# Altium project EN_Probe_VR_2.PrjPcb
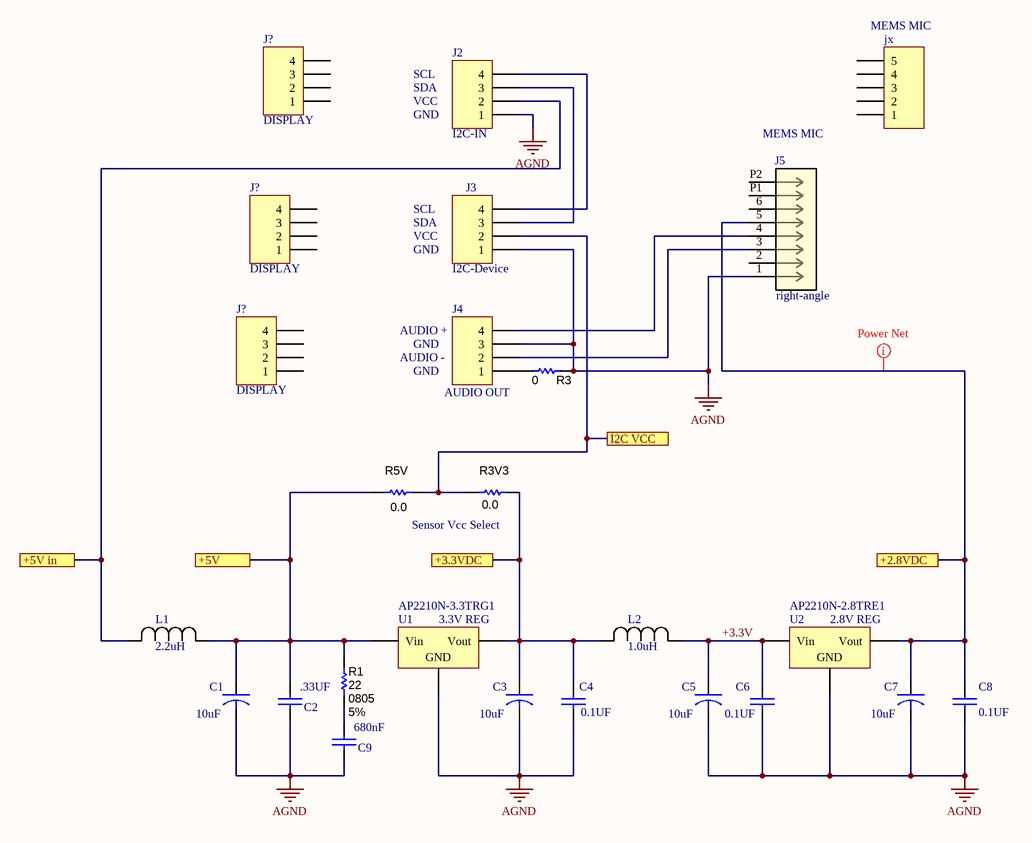
[diagram p0: EN_Probe_VR_Chain_2.SchDoc]
1 sheet, 25 parts. Net scope: flat (ports and power ports of the same name join across sheets).
Board file: EN_Probe_VR_2.PcbDoc

## Sheet EN_Probe_VR_Chain_2.SchDoc
size B

### Parts
(Parts that share a designator on the sheet are numbered #1, #2 ... from top to bottom, then left to right.)
C1  10uF  [0805]
C2  .33UF  [0805]
C3  10uF  [0805]
C4  0.1UF  [0603]
C5  10uF  [0805]
C6  0.1UF  [0603]
C7  10uF  [0805]
C8  0.1UF  [0603]
C9  680nF  [0805]
J2  I2C-IN  [HDRA1X4 2MM]
J3  I2C-Device  [HDRA1X4 2MM]
J4  AUDIO OUT  [HDRA1X4 2MM]
J5  MEMS MIC  [CON_527450697_MOL]
J?#1  DISPLAY  [HDR1X4]
J?#2  DISPLAY  [HDR1X4]
J?#3  DISPLAY  [HDR1X4]
jx  MEMS MIC  [HDR1X5]
L1  2.2uH  [1206]
L2  1.0uH  [1206]
R1  ValueDisplayed: 22  Value1: 5%  [0805]  (hidden comment: CRCW080522R0JNEA)
R3  ValueDisplayed: 0  [0805]  (hidden comment: CRCW080522R0JNEA)
R3V3  ValueDisplayed: 0.0  [0805]  (hidden comment: CRCW080522R0JNEA)
R5V  ValueDisplayed: 0.0  [0805]  (hidden comment: CRCW080522R0JNEA)
U1  3.3V REG  [SOT23-3]
U2  2.8V REG  [SOT23-3]

### Ports
+2.8VDC, +3.3VDC, +5V, +5V in, I2C VCC

### Nets
AGND: C1.2 C2.1 C3.2 C4.2 C5.2 C6.1 C7.2 C8.1 C9.1 J2.1 J3.1 J4.3 J5.1 R3.1 U1.1(GND) U2.1(GND)
+3.3V: C5.1 C6.2 L2.1 U2.3(Vin)
NetC1_1: C1.1 C2.2 L1.1 R1.2 R5V.2 U1.3(Vin) ; port +5V
NetC3_1: C3.1 C4.1 L2.2 R3V3.2 U1.2(Vout) ; port +3.3VDC
NetC7_1: C7.1 C8.2 J5.5 U2.2(Vout) ; port +2.8VDC
NetC9_2: C9.2 R1.1
NetJ2_2: J2.2 L1.2 ; port +5V in
NetJ2_3: J2.3 J3.3
NetJ2_4: J2.4 J3.4
NetJ3_2: J3.2 R3V3.1 R5V.1 ; port I2C VCC
NetJ4_1: J4.1 R3.2
NetJ4_2: J4.2 J5.3
NetJ4_4: J4.4 J5.4

Not connected (* = marked no-connect by the designer): J5 2 6 P1 P2; J?#1 1 2 3 4; J?#2 1 2 3 4; J?#3 1 2 3 4; jx 1 2 3 4 5

### Layout directives
net class Power Nets: NetC7_1

### Notes on the sheet
- SDA
- SCL
- VCC
- GND
- (near J5) right-angle
- (near J4) AUDIO +
- (near J4) AUDIO -
- Sensor Vcc Select
- (near U1) AP2210N-3.3TRG1
- (near U2) AP2210N-2.8TRE1

### Library data of the parts
C1 C3 C5 C7 = CAPACITOR: CAP CER 10UF 25V X5R 0805; Manufacturer Part Number 1: GRM21BR61E106MA73L; Vendor: DIGIKEY; Vendor PN: 490-10748-1-ND; Supplier Part Number 1: 490-10748-1-ND
C2 C9 = CAP: CAP CER 0.33UF 25V X7R 0805; Manufacturer PN: CL21B334KAFNNNG; Vendor: DIGIKEY; Vendor PN: 1276-6479-1-ND; Supplier 1: Digi-Key; Supplier Part Number 1: 1276-6479-1-ND
C4 C6 C8 = CAP: CAP CER 0.1UF 50V X7R 0603; Part Field 1: 0; Part Field 10: 1000u; Manufacturer PN: C0603C104M5RACTU; Vendor: DIGIKEY; Vendor PN: 399-7845-1-ND; Part Field 5: 1; Part Field 6: 0; Part Field 7: 1u; Part Field 8: 1u; Part Field 9: 500u; Manufacturer Part Number 1: C0603C104M5RACTU; Supplier Part Number 1: 399-7845-2-ND
J2-J4 J?#1-J?#3 = Header 4: CONN HEADER VERT 4POS .100 TIN; Manufacturer PN: 640454-4; Manufacturer: TE Connectivity AMP Connectors; Vendor PN: A19431-ND; LatestRevisionDate: 17-Jul-2002; LatestRevisionNote: Re-released for DXP Platform.; Publisher: Altium Limited; Supplier 1: Digi-Key; Supplier Part Number 1: S1012EC-04-ND
  J4: Supplier 2: Digi-Key; Supplier Part Number 2: 455-1721-ND
J5 = 527450697: No Description Available; Mfr_Name: Molex Connector Corporation; Copyright: Copyright (C) 2023 Ultra Librarian. All rights reserved.; Manufacturer_Part_Number: 527450697; RefDes: RefDes; Type: DEV
jx = 5: CONN HEADER VERT 5POS 2.54MM; Manufacturer: Harwin Inc.; Manufacturer PN: 61300511121; ID: 5; Vendor: Digikey; Vendor PN: 952-2246-ND; Part Type: Male Pin Header; Package: TH; Supplier 1: Digi-Key; Supplier Part Number 1: 732-5318-ND
L1 L2 = HI1206T161R-10: FERRITE BEAD 160 OHM 1206 1LN; Vendor: Laird; Built_By: EMA_Cory; SourceLibrary: Laird_2019-12-03; Type: DEV; Manufacturer_Part_Number: HI1206T161R-10; Copyright: Copyright (C) 2018 Accelerated Designs. All rights reserved; RefDes: RefDes; Supplier 1: Digi-Key; Supplier Part Number 1: 240-2411-1-ND
R1 R3 R3V3 R5V = CRCW080522R0JNEA: RES, 22, 5%, 0.125 W, 0805; Manufacturer: Vishay-Dale; CompType: Resistor; Value: 22; Value_Code: 22R0; Tolerance_%: 5; Power_W: 0.125; Value2: 0.125W; VDC_V: 150; TempCo: 200 ppm/C; SizeArea_mm2: 2.5; SizeX_mm: 2; SizeY_mm: 1.25; SizeZ_mm: 1.45; EIA_Code: E24; U/M: EA; AEC Category: Q200; Green_Lifecycle: Active; Green_REACh: Passed; SymbolVersion: 2009-05-29; PartNumber: CRCW080522R0JNEA; RoHS: Y; Res_ohm: 22; MountType: SMT; Technology: Thick Film; Published: 2008-06-26; Publisher: Texas Instruments; LatestRevisionDate: 2017-06-14; ComponentLink1Description: Datasheet link; ComponentLink1URL: http://www.vishay.com/docs/20035/dcrcwe3.pdf; Supplier 1: Digi-Key; Supplier Part Number 1: 541-22ACT-ND; Supplier 2: Newark; Supplier Part Number 2: 59M6875; Supplier 3: Mouser; Supplier Part Number 3: 71-CRCW080522R0JNEA; AEC Qualified: ?; Green_EU RoHS: Passed with Exemption; Green_EU RoHS-2: Passed; PackageReference: 0805
  R3 R3V3 R5V: Value1: 5%
U1 = Volt Reg: IC REG LINEAR 3.3V 300MA SOT23-3; Manufacturer Part Number 1: AP2210N-2.8TRE1; Published: 24-Mar-1999; Publisher: Altium Limited; Supplier 1: Digi-Key; Supplier Part Number 1: AP2210N-2.8TRE1-ND; Supplier 2: Digi-Key; Supplier Part Number 2: MC78M12CDTRKGOSCT-ND
U2 = Volt Reg: IC REG LINEAR 2.8V 300MA SOT23-3; Manufacturer Part Number 1: AP2210N-2.8TRE1; Published: 24-Mar-1999; Publisher: Altium Limited; Supplier 1: Digi-Key; Supplier Part Number 1: AP2210N-2.8TRE1-ND; Supplier 2: Digi-Key; Supplier Part Number 2: MC78M12CDTRKGOSCT-ND